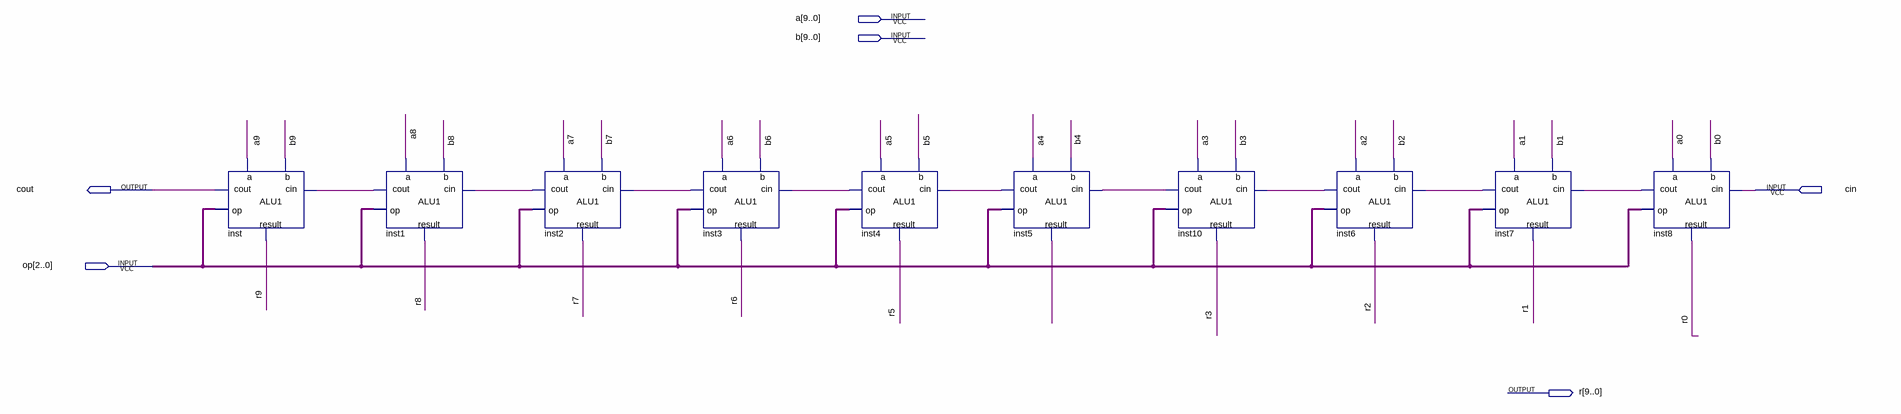
[diagram p0: schematic sheet]
// Quartus schematic alu10.bdf as structural Verilog: 10 symbols, 6 pins
module alu10 (
  input  [9:0] a,
  input  [9:0] b,
  input  cin,
  input  [2:0] op,
  output cout,
  output [9:0] r
);

  wire inst1_cout, inst2_cout, inst3_cout, inst4_cout, inst5_cout, inst5_result, inst6_cout, inst7_cout,
       inst8_cout, inst10_cout;

  ALU1 inst (.a(a[9]), .b(b[9]), .cin(inst1_cout), .op(op), .cout(cout), .result(r[9]));
  ALU1 inst1 (.a(a[8]), .b(b[8]), .cin(inst2_cout), .op(op), .cout(inst1_cout), .result(r[8]));
  ALU1 inst2 (.a(a[7]), .b(b[7]), .cin(inst3_cout), .op(op), .cout(inst2_cout), .result(r[7]));
  ALU1 inst3 (.a(a[6]), .b(b[6]), .cin(inst4_cout), .op(op), .cout(inst3_cout), .result(r[6]));
  ALU1 inst4 (.a(a[5]), .b(b[5]), .cin(inst5_cout), .op(op), .cout(inst4_cout), .result(r[5]));
  ALU1 inst5 (.a(a[4]), .b(b[4]), .cin(inst10_cout), .op(op), .cout(inst5_cout), .result(inst5_result));
  ALU1 inst10 (.a(a[3]), .b(b[3]), .cin(inst6_cout), .op(op), .cout(inst10_cout), .result(r[3]));
  ALU1 inst6 (.a(a[2]), .b(b[2]), .cin(inst7_cout), .op(op), .cout(inst6_cout), .result(r[2]));
  ALU1 inst7 (.a(a[1]), .b(b[1]), .cin(inst8_cout), .op(op), .cout(inst7_cout), .result(r[1]));
  ALU1 inst8 (.a(a[0]), .b(b[0]), .cin(cin), .op(op), .cout(inst8_cout), .result(r[0]));
endmodule
